# Altium project sdram_xsds.PrjPcb
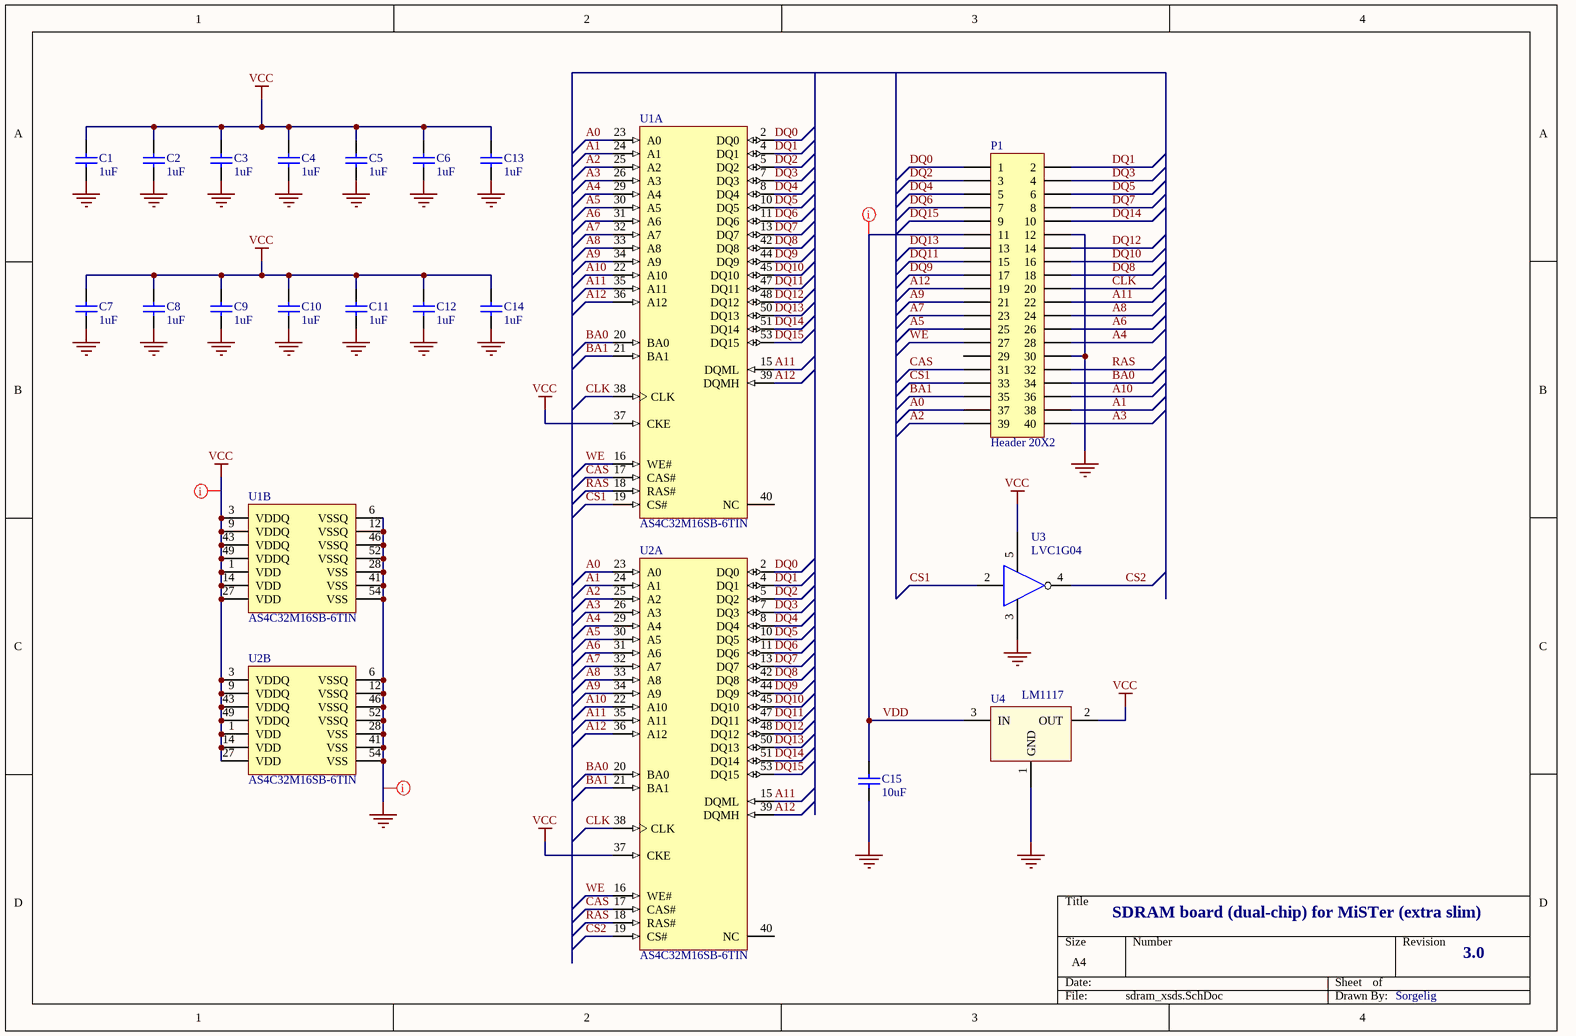
[diagram p0: sdram_xsds.SchDoc]
1 sheet, 20 parts. Net scope: global (net labels, ports and power ports of the same name join across sheets).
Board file: sdram_xsds.PcbDoc

## Sheet sdram_xsds.SchDoc
size A4

### Parts
C1  value 1uF  [C0805]  (hidden comment: C0805)
C2  value 1uF  [C0805]  (hidden comment: C0805)
C3  value 1uF  [C0805]  (hidden comment: C0805)
C4  value 1uF  [C0805]  (hidden comment: C0805)
C5  value 1uF  [C0805]  (hidden comment: +)
C6  value 1uF  [C0805]  (hidden comment: +)
C7  value 1uF  [C0805]  (hidden comment: C0805)
C8  value 1uF  [C0805]  (hidden comment: C0805)
C9  value 1uF  [C0805]  (hidden comment: +)
C10  value 1uF  [C0805]  (hidden comment: C0805)
C11  value 1uF  [C0805]  (hidden comment: C0805)
C12  value 1uF  [C0805]  (hidden comment: +)
C13  value 1uF  [C0805]  (hidden comment: +)
C14  value 1uF  [C0805]  (hidden comment: +)
C15  value 10uF  [C0805]  (hidden comment: +)
P1  Header 20X2  [HDR20x2_90 SMD]
U1  AS4C32M16SB-6TIN  [TSOP54]  (parts A,B of 2)
U2  AS4C32M16SB-6TIN  [TSOP54]  (parts A,B of 2)
U3  LVC1G04  [SOT23/70-5]
U4  LM1117  [SOT89]

### Nets
GND: C1.1 C2.1 C3.1 C4.1 C5.1 C6.1 C7.1 C8.1 C9.1 C10.1 C11.1 C12.1 C13.1 C14.1 C15.1 P1.12 P1.30 U1.6(VSSQ) U1.12(VSSQ) U1.28(VSS) U1.41(VSS) U1.46(VSSQ) U1.52(VSSQ) U1.54(VSS) U2.6(VSSQ) U2.12(VSSQ) U2.28(VSS) U2.41(VSS) U2.46(VSSQ) U2.52(VSSQ) U2.54(VSS) U3.3(GND) U4.1(GND)
VCC: C1.2 C2.2 C3.2 C4.2 C5.2 C6.2 C7.2 C8.2 C9.2 C10.2 C11.2 C12.2 C13.2 C14.2 U1.1(VDD) U1.3(VDDQ) U1.9(VDDQ) U1.14(VDD) U1.27(VDD) U1.37(CKE) U1.43(VDDQ) U1.49(VDDQ) U2.1(VDD) U2.3(VDDQ) U2.9(VDDQ) U2.14(VDD) U2.27(VDD) U2.37(CKE) U2.43(VDDQ) U2.49(VDDQ) U3.5(VCC) U4.2(OUT)
A0: P1.37 U1.23(A0) U2.23(A0)
A1: P1.38 U1.24(A1) U2.24(A1)
A2: P1.39 U1.25(A2) U2.25(A2)
A3: P1.40 U1.26(A3) U2.26(A3)
A4: P1.28 U1.29(A4) U2.29(A4)
A5: P1.25 U1.30(A5) U2.30(A5)
A6: P1.26 U1.31(A6) U2.31(A6)
A7: P1.23 U1.32(A7) U2.32(A7)
A8: P1.24 U1.33(A8) U2.33(A8)
A9: P1.21 U1.34(A9) U2.34(A9)
A10: P1.36 U1.22(A10) U2.22(A10)
A11: P1.22 U1.15(DQML) U1.35(A11) U2.15(DQML) U2.35(A11)
A12: P1.19 U1.36(A12) U1.39(DQMH) U2.36(A12) U2.39(DQMH)
BA0: P1.34 U1.20(BA0) U2.20(BA0)
BA1: P1.35 U1.21(BA1) U2.21(BA1)
CAS: P1.31 U1.17(CAS#) U2.17(CAS#)
CLK: P1.20 U1.38(CLK) U2.38(CLK)
CS1: P1.33 U1.19(CS#) U3.2(A)
CS2: U2.19(CS#) U3.4(Y)
DQ0: P1.1 U1.2(DQ0) U2.2(DQ0)
DQ1: P1.2 U1.4(DQ1) U2.4(DQ1)
DQ2: P1.3 U1.5(DQ2) U2.5(DQ2)
DQ3: P1.4 U1.7(DQ3) U2.7(DQ3)
DQ4: P1.5 U1.8(DQ4) U2.8(DQ4)
DQ5: P1.6 U1.10(DQ5) U2.10(DQ5)
DQ6: P1.7 U1.11(DQ6) U2.11(DQ6)
DQ7: P1.8 U1.13(DQ7) U2.13(DQ7)
DQ8: P1.18 U1.42(DQ8) U2.42(DQ8)
DQ9: P1.17 U1.44(DQ9) U2.44(DQ9)
DQ10: P1.16 U1.45(DQ10) U2.45(DQ10)
DQ11: P1.15 U1.47(DQ11) U2.47(DQ11)
DQ12: P1.14 U1.48(DQ12) U2.48(DQ12)
DQ13: P1.13 U1.50(DQ13) U2.50(DQ13)
DQ14: P1.10 U1.51(DQ14) U2.51(DQ14)
DQ15: P1.9 U1.53(DQ15) U2.53(DQ15)
RAS: P1.32 U1.18(RAS#) U2.18(RAS#)
VDD: C15.2 P1.11 U4.3(IN)
WE: P1.27 U1.16(WE#) U2.16(WE#)

Not connected (* = marked no-connect by the designer): P1 29; U1 40(NC); U2 40(NC)

### Layout directives
net class power: GND, VCC, VDD

### Notes on the sheet
- SDRAM board (dual-chip) for MiSTer (extra slim)
- 3.0
- Sorgelig

### Library data of the parts
C1-C15 = C0805: Ceramic Chip Capacitor - Standard; Note: Footprint corresponds to dimensions for bulk cassette packaging. This case size has tightened tolerances.; Published: 17-Jul-2002; LatestRevisionDate: 19-Mar-2004; LatestRevisionNote: Silkscreen size reduced.; DatasheetDocument: Mar-2001; PackageDocument: Mar-2001; PackageReference: 0805; Publisher: Altium Limited; Code_JEITA: 0805; Code_IPC: 2012[0805]; ComponentLink1Description: Manufacturer Link; ComponentLink1URL: http://www.kemet.com/; ComponentLink2Description: Datasheet; ComponentLink2URL: http://www.kemet.com/kemet/web/homepage/kechome.nsf/vapubfilesname/F3102TA.pdf/$file/F3102TA.pdf
P1 = Header 20X2: Header, 20-Pin, Dual row; LatestRevisionDate: 17-Jul-2002; LatestRevisionNote: Re-released for DXP Platform.; Publisher: Altium Limited
U1 U2 = AS4C16M16SA-6TCN: 256Mb SDR SDRAM, 16Mb x 16, 6ns, 3.3V, 54-Pin TSOP; Manufacturer: Micron; PartNumber: MT48LC16M16A2P-6A; CL: CL = 3; Clock Rate: 167 MHz; Data Rate: PC133; Op. Temp.: 0C to +70C; DatasheetVersion: Rev.Q; PackageVersion: Rev.Q; PackageReference: MICT-P-54; PackageDescription: 54-Pin Thin Small Outline Package, 10.16 x 22.22 mm, Pitch 0.8 mm; Cycle Time: 6ns; Density: 256Mb; Depth: 16Mb; RoHS: Yes; Voltage: 3.3V; Width: x16; Mounting Technology: Surface Mount; ComponentLink1Description: Manufacturer URL; ComponentLink1URL: http://www.micron.com/; ComponentLink2Description: Datasheet; ComponentLink2URL: http://www.micron.com/~/media/Documents/Products/Data%20Sheet/DRAM/256Mb_sdr.pdf; ComponentLink3Description: Package Specification; ComponentLink3URL: http://www.micron.com/~/media/Documents/Products/Data%20Sheet/DRAM/128mb_x4x8x16_sdram.pdf
U3 = LVC1G04: INVERTER; Geometry.Height: 1.45mm; Supplier_Name: RS; RS Part Number: *; Allied_Number: *; Other Part Number: *; 3D Package: *